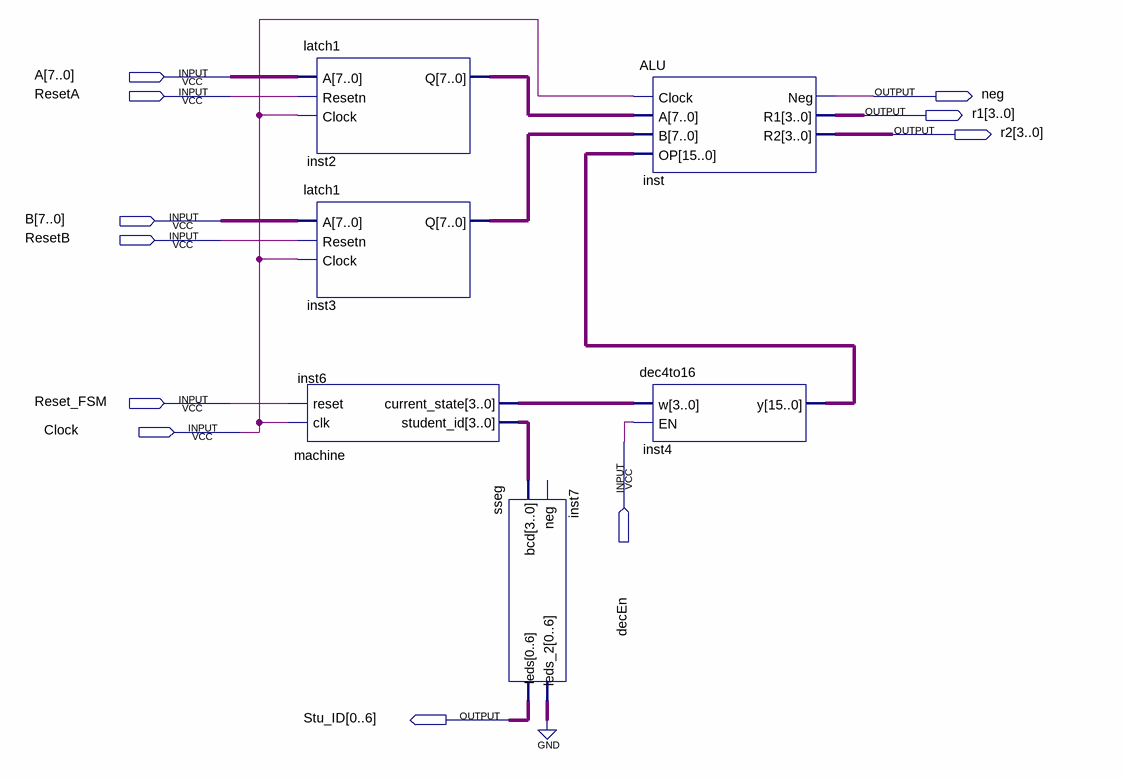
[diagram p0: schematic sheet]
// Quartus schematic BlockTest.bdf as structural Verilog: 6 symbols, 11 pins
module BlockTest (
  input  [7:0] A,
  input  ResetA,
  input  [7:0] B,
  input  ResetB,
  input  Reset_FSM,
  input  Clock,
  input  decEn,
  output neg,
  output [3:0] r1,
  output [3:0] r2,
  output [0:6] Stu_ID
);

  wire [3:0] inst6_current_state, inst6_student_id;
  wire [6:0] inst7_leds_2;
  wire [7:0] inst2_q, inst3_q;
  wire [15:0] inst4_y;

  latch1 inst2 (.A(A), .Resetn(ResetA), .Clock(Clock), .Q(inst2_q));
  latch1 inst3 (.A(B), .Resetn(ResetB), .Clock(Clock), .Q(inst3_q));
  machine inst6 (.clk(Clock), .reset(Reset_FSM), .student_id(inst6_student_id), .current_state(inst6_current_state));
  sseg inst7 (.bcd(inst6_student_id), .leds(Stu_ID), .leds_2(inst7_leds_2));  // open: neg
  ALU inst (.Clock(Clock), .A(inst2_q), .B(inst3_q), .OP(inst4_y), .Neg(neg), .R1(r1), .R2(r2));
  dec4to16 inst4 (.w(inst6_current_state), .EN(decEn), .y(inst4_y));
  // also tied to GND on the sheet: {inst7_leds_2[0], inst7_leds_2[1], inst7_leds_2[2], inst7_leds_2[3], inst7_leds_2[4], inst7_leds_2[5], inst7_leds_2[6]}
endmodule
